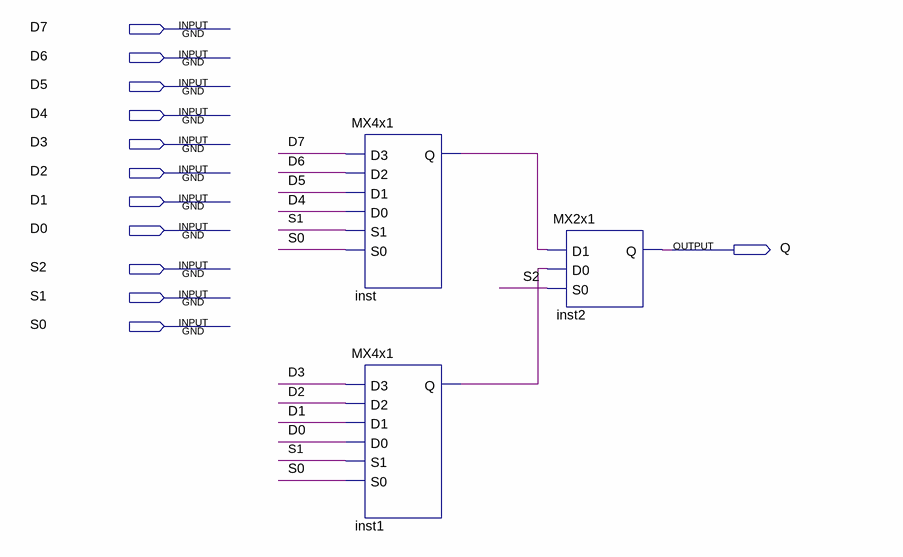
[diagram p0: schematic sheet]
// Quartus schematic MX8x1.bdf as structural Verilog: 3 symbols, 12 pins
module MX8x1 (
  input  D7,
  input  D6,
  input  D5,
  input  D4,
  input  D3,
  input  D2,
  input  D1,
  input  D0,
  input  S2,
  input  S1,
  input  S0,
  output Q
);

  wire inst1_q, inst_q;

  MX4x1 inst (.D3(D7), .D2(D6), .D1(D5), .D0(D4), .S1(S1), .S0(S0), .Q(inst_q));
  MX4x1 inst1 (.D3(D3), .D2(D2), .D1(D1), .D0(D0), .S1(S1), .S0(S0), .Q(inst1_q));
  MX2x1 inst2 (.D1(inst_q), .D0(inst1_q), .S0(S2), .Q(Q));
endmodule
